# EAGLE design ece411-t03-voice-recognizer (EAGLE 9.2.1)
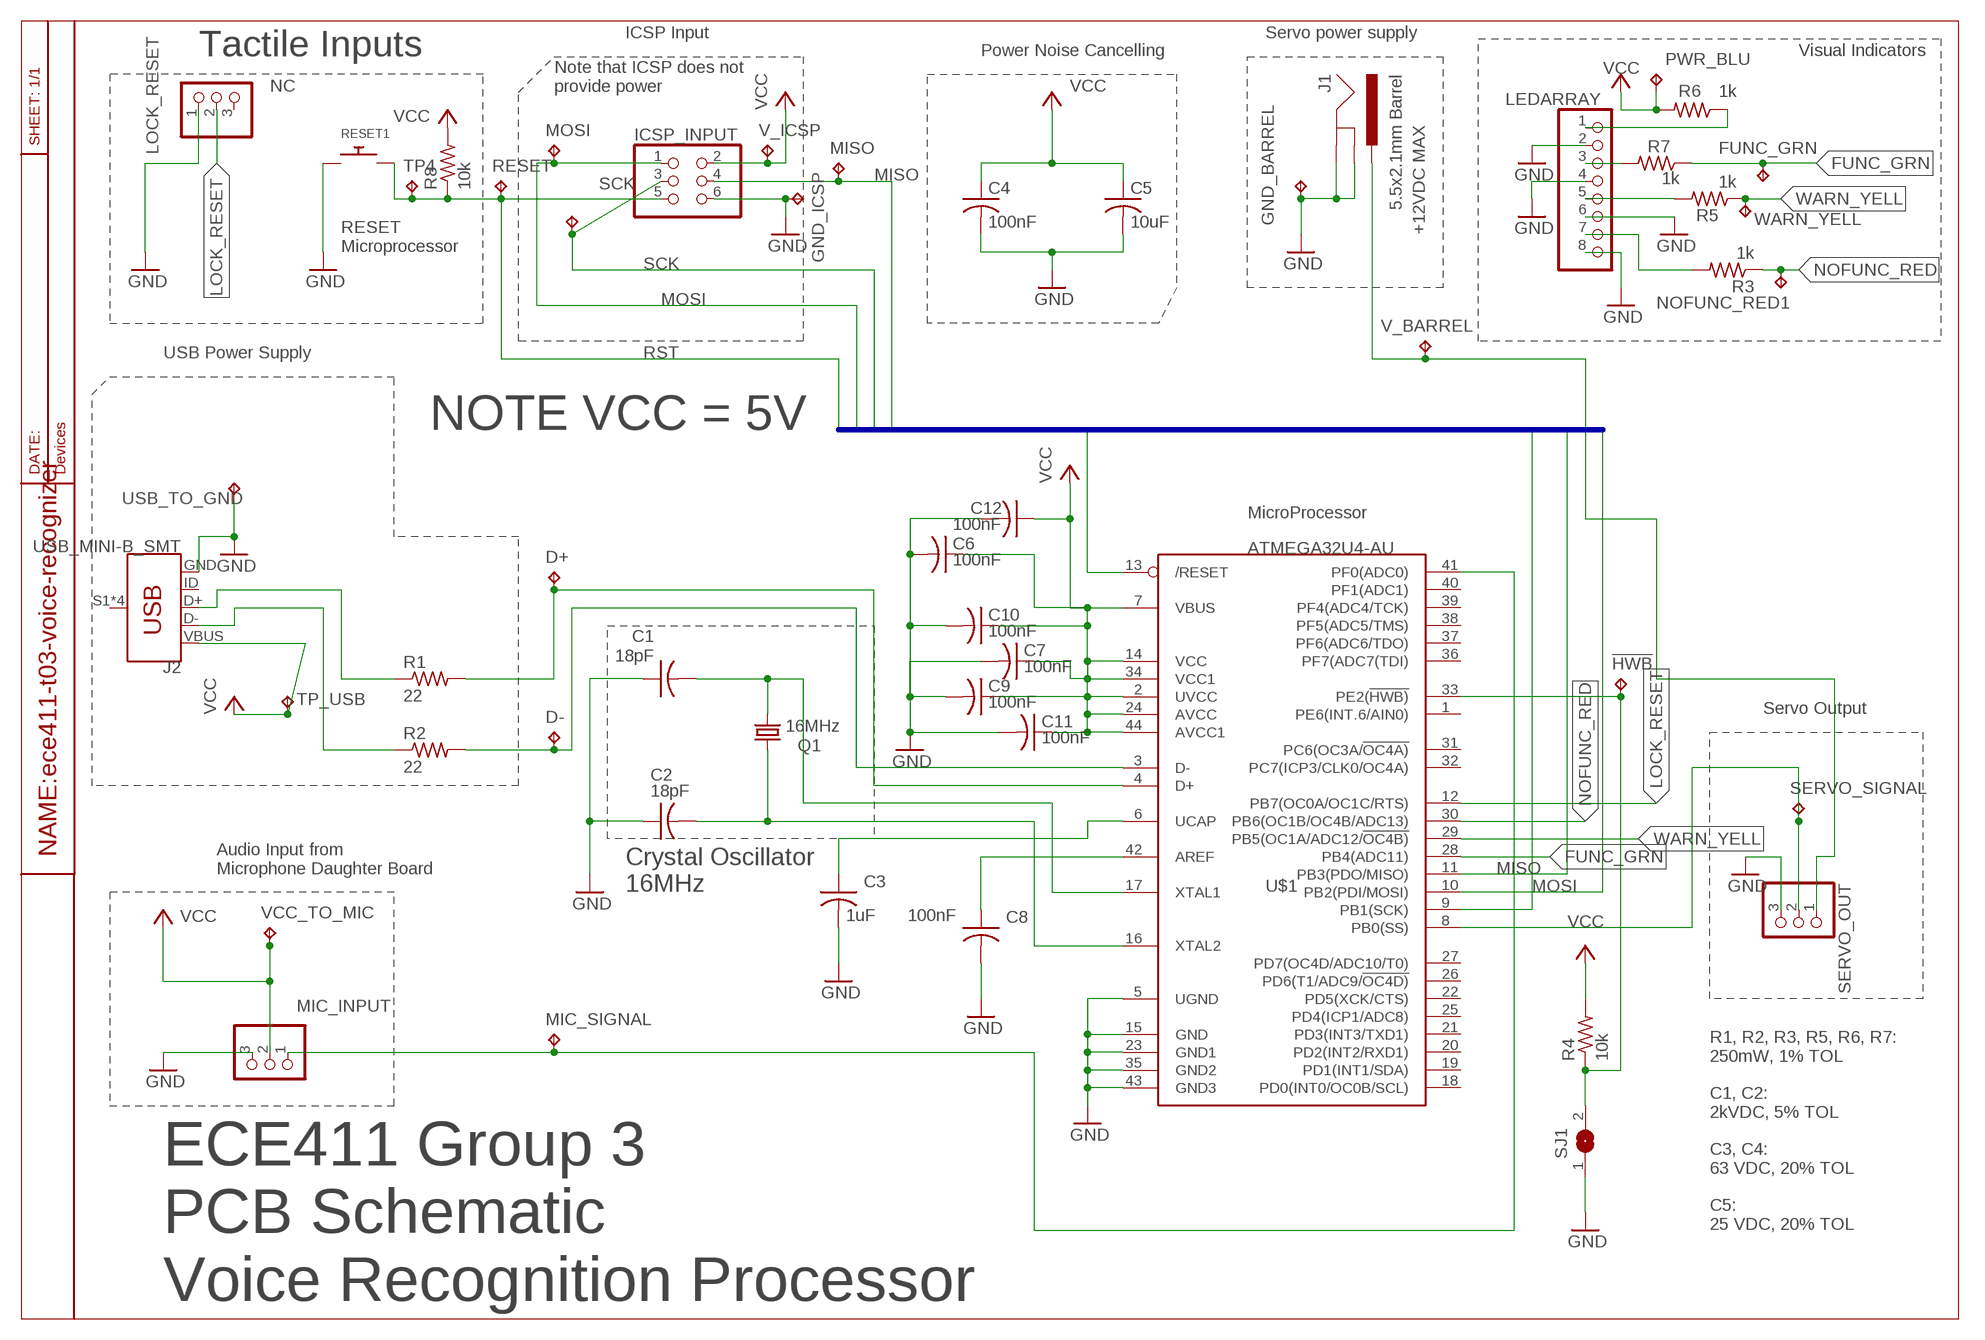
[diagram p0: schematic, sheet 1]

## Parts
!HWB  TPTP15SQ  [TP15SQ]
C1  18pF  C-USC1206  [C1206]
C2  18pF  C-USC1206  [C1206]
C3  1uF  C-USC1206  [C1206]
C4  100nF  C-USC1206  [C1206]
C5  10uF  C-USC1206  [C1206]
C6  100nF  C-USC1206  [C1206]
C7  100nF  C-USC1206  [C1206]
C8  100nF  C-USC1206  [C1206]
C9  100nF  C-USC1206  [C1206]
C10  100nF  C-USC1206  [C1206]
C11  100nF  C-USC1206  [C1206]
C12  100nF  C-USC1206  [C1206]
D+  TPTP15SQ  [TP15SQ]
D-  TPTP15SQ  [TP15SQ]
FUNC_GRN  TPTP15SQ  [TP15SQ]
GND_BARREL  TPTP15SQ  [TP15SQ]
GND_ICSP  TPTP15SQ  [TP15SQ]
ICSP_INPUT  PINHD-2X3  [2X03]
J1  5.5x2.1mm Barrel  POWER_JACKSMD  [POWER_JACK_SMD]
J2  USB_MINI-B_SMT  [USB-MINIB]
LEDARRAY  PINHD-1X8BIG  [1X08-BIG]
LOCK_RESET  PINHD-1X3  [1X03]
MIC_INPUT  PINHD-1X3  [1X03]
MIC_SIGNAL  TPTP15SQ  [TP15SQ]
MISO  TPTP15SQ  [TP15SQ]
MOSI  TPTP15SQ  [TP15SQ]
NOFUNC_RED1  TPTP15SQ  [TP15SQ]
PWR_BLU  TPTP15SQ  [TP15SQ]
Q1  16MHz  CRYSTALCTS406  [CTS406]
R1  22  R-US_M1206  [M1206]
R2  22  R-US_M1206  [M1206]
R3  1k  R-US_M1206  [M1206]
R4  10k  R-US_M1206  [M1206]
R5  1k  R-US_M1206  [M1206]
R6  1k  R-US_M1206  [M1206]
R7  1k  R-US_M1206  [M1206]
R8  10k  R-US_M1206  [M1206]
RESET  TPTP15SQ  [TP15SQ]
RESET1  SWITCH_PUSHBUTTONC&K_KSS  [BTN_CK_KSS]
SCK  TPTP15SQ  [TP15SQ]
SERVO_OUT  PINHD-1X3  [1X03]
SERVO_SIGNAL  TPTP15SQ  [TP15SQ]
SJ1  SJW  [SJW]
TP4  TPTP15SQ  [TP15SQ]
TP_USB  TPTP15SQ  [TP15SQ]
U$1  ATMEGA32U4-AU  [TQFP44]
USB_TO_GND  TPTP15SQ  [TP15SQ]
V_BARREL  TPTP15SQ  [TP15SQ]
V_ICSP  TPTP15SQ  [TP15SQ]
VCC_TO_MIC  TPTP15SQ  [TP15SQ]
WARN_YELL  TPTP15SQ  [TP15SQ]

## Nets
FUNC_GRN: FUNC_GRN.TP R7.1 U$1.28(PB4(ADC11))
GND: C1.1 C2.1 C3.2 C4.2 C5.2 C6.2 C7.2 C8.2 C9.2 C10.2 C11.2 C12.2 GND_BARREL.TP GND_ICSP.TP ICSP_INPUT.6 J1.GND(GNDBREAK) J1.P$4(GND) J2.GND LEDARRAY.2 LEDARRAY.4 LEDARRAY.6 LEDARRAY.8 LOCK_RESET.1 MIC_INPUT.3 RESET1.P$1 SERVO_OUT.3 SJ1.1 U$1.5(UGND) U$1.15(GND) U$1.23(GND1) U$1.35(GND2) U$1.43(GND3) USB_TO_GND.TP
HWB: !HWB.TP R4.1 SJ1.2 U$1.33(PE2(!HWB))
LOCK_RESET: LOCK_RESET.2 U$1.12(PB7(OC0A/OC1C/RTS))
MIC_SIGNAL: MIC_INPUT.1 MIC_SIGNAL.TP U$1.41(PF0(ADC0))
MISO: ICSP_INPUT.4 MISO.TP U$1.11(PB3(PDO/MISO))
MOSI: ICSP_INPUT.1 MOSI.TP U$1.10(PB2(PDI/MOSI))
N$1: C3.1 U$1.6(UCAP)
N$2: C1.2 Q1.3 U$1.17(XTAL1)
N$3: J2.D+ R1.1
N$4: LEDARRAY.1 R6.1
N$5: LEDARRAY.5 R5.2
N$6: LEDARRAY.7 R3.2
N$7: J1.VIN0(PWR) SERVO_OUT.1 V_BARREL.TP
N$8: LEDARRAY.3 R7.2
N$9: J2.D- R2.1
N$12: D+.TP R1.2 U$1.4(D+)
N$14: C8.1 U$1.42(AREF)
N$20: D-.TP R2.2 U$1.3(D-)
N$22: C2.2 Q1.1 U$1.16(XTAL2)
NOFUNC_RED: NOFUNC_RED1.TP R3.1 U$1.30(PB6(OC1B/OC4B/ADC13))
RST: ICSP_INPUT.5 R8.1 RESET1.P$2 RESET.TP TP4.TP U$1.13(/RESET)
SCK: ICSP_INPUT.3 SCK.TP U$1.9(PB1(SCK))
SIGNAL: SERVO_OUT.2 SERVO_SIGNAL.TP U$1.8(PB0(SS))
VCC: C4.1 C5.1 C6.1 C7.1 C9.1 C10.1 C11.1 C12.1 ICSP_INPUT.2 J2.VBUS MIC_INPUT.2 PWR_BLU.TP R4.2 R6.2 R8.2 TP_USB.TP U$1.2(UVCC) U$1.7(VBUS) U$1.14(VCC) U$1.24(AVCC) U$1.34(VCC1) U$1.44(AVCC1) V_ICSP.TP VCC_TO_MIC.TP
WARN_YELL: R5.1 U$1.29(PB5(OC1A/ADC12/!OC4B)) WARN_YELL.TP
Unconnected: J2.ID J2.S1(SHIELD) J2.S2(SHIELD) J2.S3(SHIELD) J2.S4(SHIELD) LOCK_RESET.3 U$1.1(PE6(INT.6/AIN0)) U$1.18(PD0(INT0/OC0B/SCL)) U$1.19(PD1(INT1/SDA)) U$1.20(PD2(INT2/RXD1)) U$1.21(PD3(INT3/TXD1)) U$1.22(PD5(XCK/CTS)) U$1.25(PD4(ICP1/ADC8)) U$1.26(PD6(T1/ADC9/!OC4D)) U$1.27(PD7(OC4D/ADC10/T0)) U$1.31(PC6(OC3A/!OC4A)) U$1.32(PC7(ICP3/CLK0/OC4A)) U$1.36(PF7(ADC7(TDI)) U$1.37(PF6(ADC6/TDO)) U$1.38(PF5(ADC5/TMS)) U$1.39(PF4(ADC4/TCK)) U$1.40(PF1(ADC1))

## Buses
MISO,MOSI,RST,SCK

## Notes on the sheet
- ICSP Input | Servo power supply
- Tactile Inputs | Power Noise Cancelling | Visual Indicators
- NC
- Note that ICSP does not
  provide power
- +12VDC MAX
- RESET 
  Microprocessor
- USB Power Supply
- NOTE VCC = 5V
- MicroProcessor
- Servo Output
- Audio Input from 
  Microphone Daughter Board
- Crystal Oscillator
  16MHz
- R1, R2, R3, R5, R6, R7:
  250mW, 1% TOL
  
  C1, C2:
  2kVDC, 5% TOL
  
  C3, C4:
  63 VDC, 20% TOL
  
  C5:
  25 VDC, 20% TOL
- ECE411 Group 3
  PCB Schematic
  Voice Recognition Processor

## Library data of the parts
!HWB D+ D- FUNC_GRN GND_BARREL GND_ICSP MIC_SIGNAL MISO MOSI NOFUNC_RED1 PWR_BLU RESET SCK SERVO_SIGNAL TP4 TP_USB USB_TO_GND V_BARREL V_ICSP VCC_TO_MIC WARN_YELL = testpad:TP: Test pad
C1-C12 = rcl:C-US: CAPACITOR, American symbol; SPICEPREFIX: C
ICSP_INPUT = pinhead:PINHD-2X3: PIN HEADER
J1 = SparkFun-Connectors:POWER_JACK: Power Jack Connector This is the standard 5.5mm barrel jack for power. The PTH is the most common, proven, reliable, footprint. The Slot footprint only works if the mill layer is transmitted to the PCB fab house so be warned. Here are the connectors we sell at SparkFun: DC Barrel Power Jack/Connector <https://www.sparkfun.com/products/119> (PRT-00119) DC Barrel Power Jack/Connector (SMD) <https://www.sparkfun.com/products/12748> (PRT-12748) DC Barrel Jack Adapter - Breadboard Compatible <https://www.sparkfun.com/products/10811> (PRT-10811) It is used on this SparkFun product (and many, many others): SparkFun RedBoard - Programmed with Arduino <https://www.sparkfun.com/products/12757> (DEV-12757) Also, if you need a mating power supply or connector, please check these out: Wall Adapter Power Supply - 9VDC 650mA <https://www.sparkfun.com/products/298> (TOL-00298) DC Barrel Jack Adapter - Male <https://www.sparkfun.com/products/10287> (PRT-10287); PROD_ID: CONN-08106; SF_ID: PRT-12748
J2 = SparkFun-Connectors:USB_MINI-B: USB type Mini-B Connector Breaks out 5th pin, and includes shield pins if needed. SparkFun Products: SparkFun FTDI Basic Breakout <https://www.sparkfun.com/products/9716> SparkFun XBee Explorer USB <https://www.sparkfun.com/products/11812> SparkFun Redboard <https://www.sparkfun.com/products/12757>; PROD_ID: CONN-08193; SF_ID: PRT-00587
LEDARRAY = adafruit:PINHD-1X8: PIN HEADER
LOCK_RESET = adafruit:PINHD-1X3: PIN HEADER
MIC_INPUT SERVO_OUT = pinhead:PINHD-1X3: PIN HEADER
Q1 = adafruit:CRYSTAL: CRYSTAL; OC_FARNELL: unknown; OC_NEWARK: unknown
R1-R8 = rcl:R-US_: RESISTOR, American symbol; SPICEPREFIX: R
RESET1 = adafruit:SWITCH_PUSHBUTTON: Buttons SOFTTOUCHSMD_SJ - Soft touch temporary push button (Super Junk Akihabara) Compatible with SKPMANE010 [Mouser: 688-SKPMAN] C&K_KSS = Digikey: KSS221GLFS
SJ1 = jumper:SJ: SMD solder JUMPER
U$1 = adafruit:ATMEGA32U4: http://www.ladyada.net/library/eagle

## Net classes
0 VCC: width 0.05 mm
1 GND: width 0.001 mm

## Board
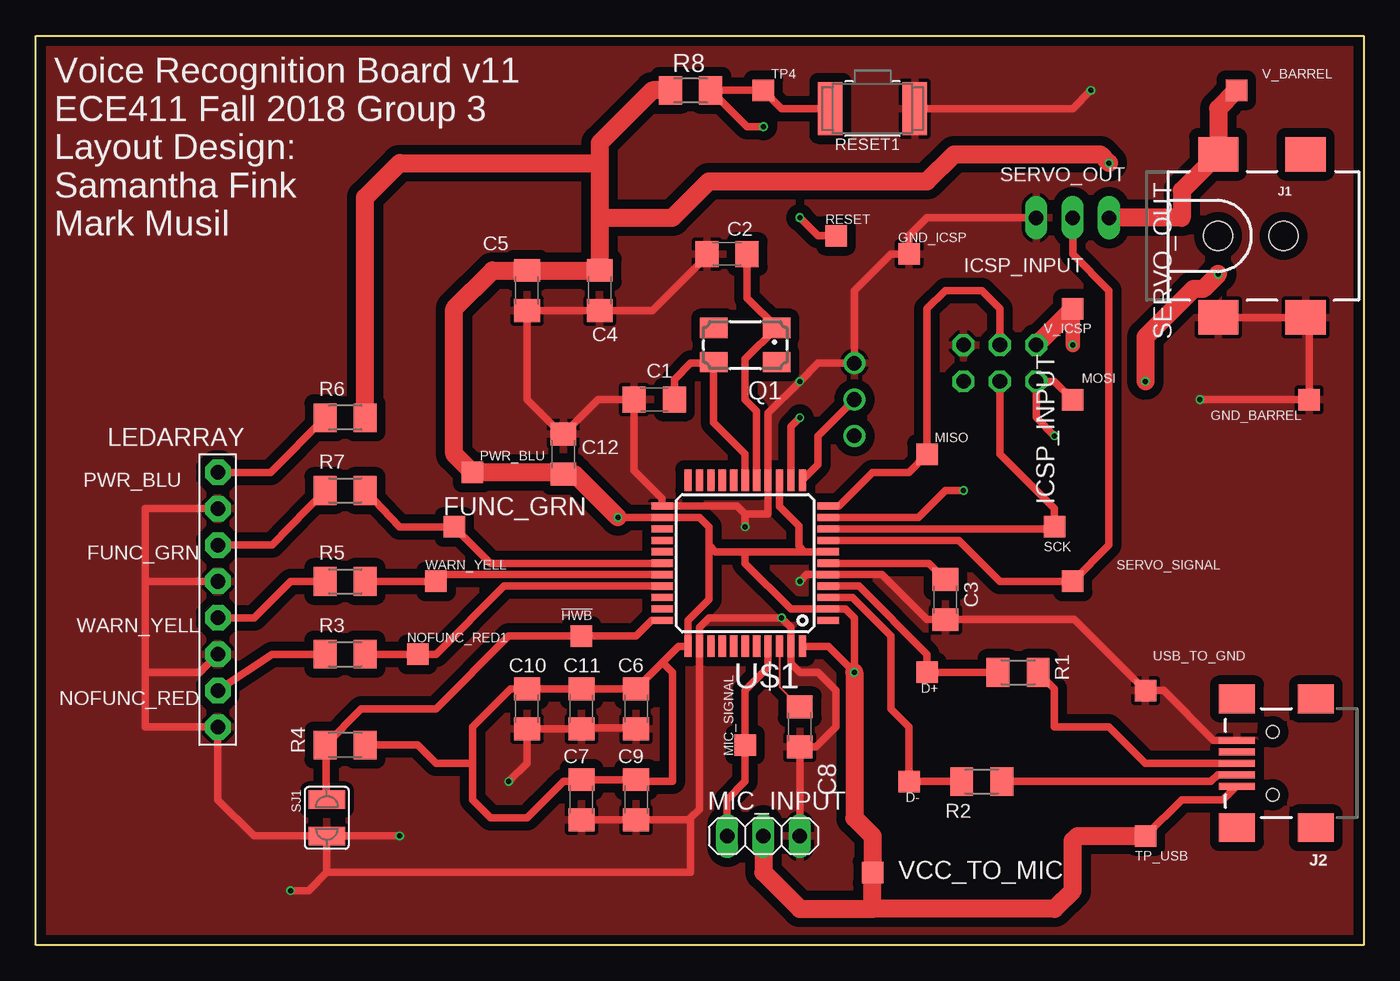
[diagram p1: board, top side]
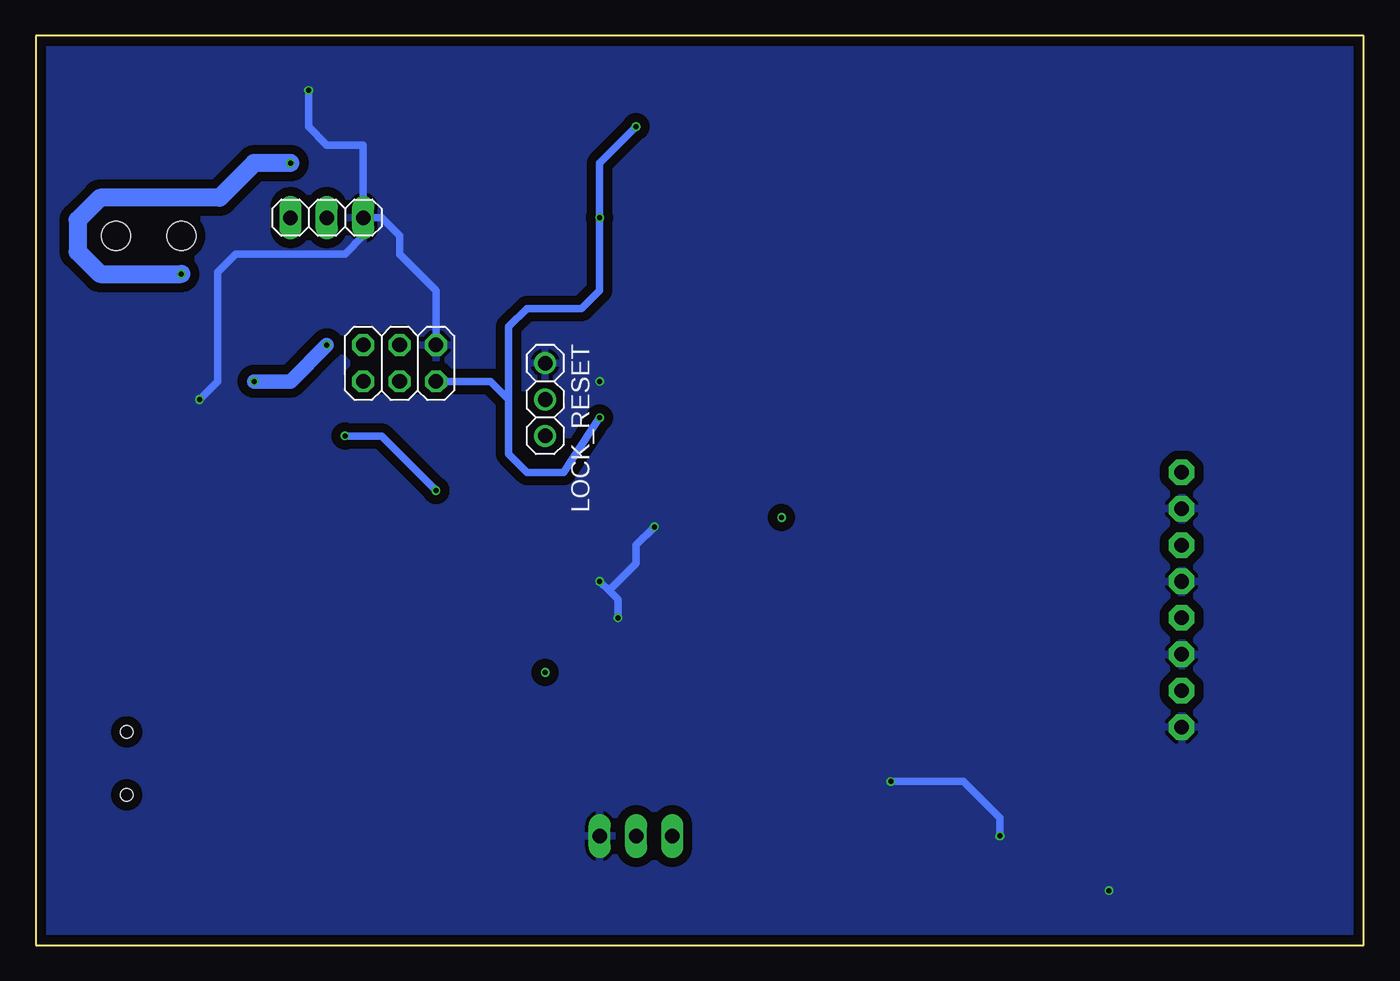
[diagram p2: board, bottom side, seen from below]

Size 92.71 x 63.5 mm. Coordinates in mm from the lower left corner, seen from the top.
Outline: 0,0 0,63.5 92.71,63.5 92.71,0 0,0
Copper layers (1*16): Top 0.035559375mm / dielectric 1.6mm / Bottom 0.035559375mm
Design rules "oshpark-2layer": minimum track width 6mil, minimum drill 10mil, track to track 6mil, track to pad 6mil, pad to pad 6mil, via to via 6mil, smd to smd 6mil, copper to edge 15mil, drill to drill 6mil, minimum pad ring 5mil, minimum via ring 5mil, stop-mask expansion 2.5mil, vias tented up to drill 0mil, thermal gap 10mil

### Footprints (pad centres in the part's own frame; a part is rotated, then mirrored left to right if it is on the bottom)
TP15SQ = smd 1.5 x 1.5: TP 0,0
C1206 = smd 1.6 x 1.8: 1 -1.4,0; 2 1.4,0
2X03 = drill 1.016 octagon: 1 -2.54,-1.27; 2 -2.54,1.27; 3 0,-1.27; 4 0,1.27; 5 2.54,-1.27; 6 2.54,1.27
POWER_JACK_SMD = smd 2.8 x 2.4: GND 0,-5.7; P$4 6.1,-5.7; VIN0 0,5.7; VIN1 6.1,5.7 | hole 2.032: 0,0; 4.572,0
USB-MINIB = smd 2.5 x 0.5: D+ 2.5,0; D- 2.5,0.8; GND 2.5,-1.6; ID 2.5,-0.8; VBUS 2.5,1.6 | smd 2.5 x 2: S1 -3,4.5; S2 2.5,4.5; S3 -3,-4.5; S4 2.5,-4.5 | hole 0.9: 0,2.2; 0,-2.2
1X08-BIG = drill 1.016 pad 1.778 octagon: 1 -8.89,0; 2 -6.35,0; 3 -3.81,0; 4 -1.27,0; 5 1.27,0; 6 3.81,0; 7 6.35,0; 8 8.89,0
1X03 = drill 1.016: 1 -2.54,0; 2 0,0; 3 2.54,0
1X03' = drill 1.016 long: 1 -2.54,0; 2 0,0; 3 2.54,0
CTS406 = smd 1.9 x 1.4: 1 -2.2,-1.2; 2 2.2,-1.2; 3 2.2,1.2; 4 -2.2,1.2
M1206 = smd 1.6 x 2: 1 -1.4,0; 2 1.4,0
BTN_CK_KSS = smd 1.7 x 3.7: P$1 -2.95,0; P$2 2.95,0
SJW = smd 1.27 x 2.54: 1 -1.27,0; 2 1.27,0
TQFP44 = smd 1.5 x 0.5: 1 -5.8,4; 2 -5.8,3.2; 3 -5.8,2.4; 4 -5.8,1.6; 5 -5.8,0.8; 6 -5.8,0; 7 -5.8,-0.8; 8 -5.8,-1.6; 9 -5.8,-2.4; 10 -5.8,-3.2; 11 -5.8,-4; 23 5.8,-4; 24 5.8,-3.2; 25 5.8,-2.4; 26 5.8,-1.6; 27 5.8,-0.8; 28 5.8,0; 29 5.8,0.8; 30 5.8,1.6; 31 5.8,2.4; 32 5.8,3.2; 33 5.8,4 | smd 0.5 x 1.5: 12 -4,-5.8; 13 -3.2,-5.8; 14 -2.4,-5.8; 15 -1.6,-5.8; 16 -0.8,-5.8; 17 0,-5.8; 18 0.8,-5.8; 19 1.6,-5.8; 20 2.4,-5.8; 21 3.2,-5.8; 22 4,-5.8; 34 4,5.8; 35 3.2,5.8; 36 2.4,5.8; 37 1.6,5.8; 38 0.8,5.8; 39 0,5.8; 40 -0.8,5.8; 41 -1.6,5.8; 42 -2.4,5.8; 43 -3.2,5.8; 44 -4,5.8

### Placement (x,y rotation side)
!HWB  38.1,21.59 0 top
C1  43.18,38.1 0 top
C2  48.26,48.26 0 top
C3  63.5,24.13 270 top
C4  39.37,45.72 270 top
C5  34.29,45.72 270 top
C6  41.91,16.51 270 top
C7  38.1,10.16 270 top
C8  53.34,15.24 270 top
C9  41.91,10.16 270 top
C10  34.29,16.51 270 top
C11  38.1,16.51 270 top
C12  36.83,34.29 90 top
D+  62.23,19.05 0 top
D-  60.96,11.43 0 top
FUNC_GRN  29.21,29.21 0 top
GND_BARREL  88.9,38.1 180 top
GND_ICSP  60.96,48.26 0 top
ICSP_INPUT  67.31,40.64 0 bottom
J1  82.55,49.53 0 top
J2  86.36,12.7 180 top
LEDARRAY  12.7,24.13 270 top
LOCK_RESET  57.15,38.1 270 bottom
MIC_INPUT  [1X03']  50.8,7.62 0 top
MIC_SIGNAL  49.53,13.97 0 top
MISO  62.23,34.29 0 top
MOSI  72.39,38.1 0 top
NOFUNC_RED1  26.67,20.32 0 top
PWR_BLU  30.48,33.02 180 top
Q1  49.53,41.91 180 top
R1  68.58,19.05 180 top
R2  66.04,11.43 180 top
R3  21.59,20.32 180 top
R4  21.59,13.97 0 top
R5  21.59,25.4 180 top
R6  21.59,36.83 0 top
R7  21.59,31.75 180 top
R8  45.72,59.69 180 top
RESET  55.88,49.53 0 top
RESET1  58.42,58.42 180 top
SCK  71.12,29.21 0 top
SERVO_OUT  [1X03']  72.39,50.8 0 bottom
SERVO_SIGNAL  72.39,25.4 0 top
SJ1  20.32,8.89 90 top
TP4  50.8,59.69 270 top
TP_USB  77.47,7.62 0 top
U$1  49.53,26.67 180 top
USB_TO_GND  77.47,17.78 0 top
V_BARREL  83.82,59.69 0 top
V_ICSP  72.39,44.45 0 top
VCC_TO_MIC  58.42,5.08 0 top
WARN_YELL  27.94,25.4 0 top

### Tracks (layer width: path | path; a pad name or v marks a point on that pad's centre or on a via)
FUNC_GRN
  Top 0.508: U$1.28 31.75,26.67 FUNC_GRN.TP 25.4,29.21 R7.1
GND  (via drill 0.35)
  Top 0.152: 55.88,25.87 U$1.5
  Top 0.508: LEDARRAY.6 11.43,19.05 7.62,19.05 | 7.62,19.05 7.62,15.24 LEDARRAY.8 12.7,10.16 15.24,7.62 SJ1.1 | LEDARRAY.4 7.62,25.4 | 7.62,25.4 7.62,19.05 | 7.62,25.4 7.62,30.48 LEDARRAY.2 | v53.34,25.4 53.81,25.87 U$1.5 | 55.88,25.87 59.09,25.87 62.23,22.73 C3.2 72.52,22.73 USB_TO_GND.TP 78.74,17.78 82.22,14.3 J2.GND | C6.2 41.97,15.18 38.17,15.18 C11.2 C10.2 34.29,12.7 v33.02,11.43 | 20.32,5.08 45.72,5.08 45.72,8.89 | 45.72,8.89 45.59,8.76 C9.2 C7.2 | C2.1 46.86,48.13 43.05,44.32 C4.2 C5.2 34.29,38.1 36.7,35.69 C12.2 39.24,38.1 C1.1 41.78,33.15 43.73,31.2 U$1.23 48.95,30.67 49.53,30.09 | 45.72,8.89 46.33,9.5 U$1.35 46.33,22.2 46.99,22.86 v52.07,22.86 52.73,22.2 U$1.43 52.73,19.66 53.34,19.05 54.61,19.05 55.88,17.78 55.88,15.24 54.48,13.84 C8.2 MIC_INPUT.3 | v25.4,7.62 SJ1.1 | SJ1.1 20.32,5.08 | v17.78,3.81 19.05,3.81 20.32,5.08 | J1.GND J1.P$4 88.9,43.58 GND_BARREL.TP v81.28,38.1 | v73.66,59.69 72.39,58.42 RESET1.P$1 | SERVO_OUT.3 62.23,50.8 60.96,49.53 GND_ICSP.TP 59.69,48.26 57.15,45.72 LOCK_RESET.1 54.61,40.64 v53.34,39.37 51.13,37.16 U$1.15 51.13,30.09 49.53,30.09 | v49.53,29.21 49.53,30.09
  Bottom 0.508: v52.07,22.86 52.07,24.13 52.7,24.77 | 52.7,24.77 v53.34,25.4 | ICSP_INPUT.6 64.77,45.72 67.31,48.26 67.31,49.53 68.58,50.8 SERVO_OUT.3 | v25.4,7.62 25.4,8.89 27.94,11.43 v33.02,11.43 | SERVO_OUT.3 69.85,49.53 71.12,48.26 78.74,48.26 80.01,46.99 80.01,39.37 v81.28,38.1 | SERVO_OUT.3 69.85,55.88 72.39,55.88 73.66,57.15 v73.66,59.69 | 52.7,24.77 50.8,26.67 50.8,27.94 v49.53,29.21
  pour Top (isolate 0.635): 0,63.5 0,0 92.71,0 92.71,63.5
  pour Bottom (isolate 0.635): 0,63.5 0,0 92.71,0 92.71,63.5
HWB
  Top 0.508: U$1.33 42.99,22.67 41.91,21.59 !HWB.TP 33.02,21.59 27.94,16.51 22.73,16.51 20.25,14.04 | 20.25,14.04 R4.1 | SJ1.2 20.25,10.22 20.25,14.04
LOCK_RESET
  Top 0.508: U$1.12 54.61,33.55 54.61,35.56 LOCK_RESET.2
MIC_SIGNAL
  Top 0.508: U$1.41 51.13,19.38 49.53,17.78 MIC_SIGNAL.TP 49.53,11.43 48.26,10.16 MIC_INPUT.1
MISO
  Top 0.508: ICSP_INPUT.4 67.31,44.45 66.04,45.72 63.5,45.72 62.23,44.45 MISO.TP 60.96,33.02 58.42,33.02 56.07,30.67 U$1.11
MOSI  (via drill 0.35)
  Top 0.508: MOSI.TP 71.12,39.37 ICSP_INPUT.1 69.85,36.83 v71.12,35.56 | U$1.10 61.62,29.87 63.5,31.75 v64.77,31.75
  Bottom 0.508: v64.77,31.75 68.58,35.56 v71.12,35.56
N$1
  Top 0.508: C3.1 62.36,26.67 U$1.6
N$2
  Top 0.152: 47.33,40.64 Q1.3 | 49.53,33.02 U$1.17
  Top 0.508: C1.2 44.58,39.5 45.72,40.64 47.33,40.64 | Q1.3 47.33,36.49 49.53,34.29 49.53,33.02
N$3
  Top 0.508: J2.D+ 77.47,12.7 74.93,15.24 71.12,15.24 71.12,17.91 R1.1
N$4
  Top 0.508: R6.1 16.38,33.02 LEDARRAY.1
N$5
  Top 0.508: R5.2 17.78,25.4 15.24,22.86 LEDARRAY.5
N$6
  Top 0.508: R3.2 16.51,20.32 LEDARRAY.7
N$7
  Top 1.27: V_BARREL.TP 82.55,58.42 J1.VIN0 80.01,52.69 80.01,50.8 SERVO_OUT.1
N$8
  Top 0.508: R7.2 16.51,27.94 LEDARRAY.3
N$9
  Top 0.508: R2.1 74.93,11.43 82.04,11.43 82.51,11.9 J2.D-
N$12
  Top 0.508: R1.2 D+.TP 62.23,20.32 57.48,25.07 U$1.4
N$14
  Top 0.152: U$1.42 51.93,18.05 C8.1
N$20
  Top 0.508: U$1.3 57.01,24.27 59.69,21.59 59.69,16.51 60.96,15.24 D-.TP R2.2
N$22
  Top 0.508: C2.2 49.66,45.18 Q1.1 49.53,40.91 49.53,38.1 50.33,37.3 U$1.16
NOFUNC_RED
  Top 0.508: U$1.30 32.69,25.07 27.94,20.32 NOFUNC_RED1.TP R3.1
RST  (via drill 0.35)
  Top 0.508: RESET1.P$2 52.07,58.42 TP4.TP R8.1 49.66,57.15 v50.8,57.15 | RESET.TP 54.61,49.53 v53.34,50.8 | v53.34,36.83 52.73,36.22 U$1.13
  Bottom 0.508: 59.69,38.1 59.69,43.18 58.42,44.45 54.61,44.45 53.34,45.72 v53.34,50.8 53.34,54.61 v50.8,57.15 | 59.69,38.1 60.96,39.37 ICSP_INPUT.5 | 59.69,38.1 59.69,34.29 58.42,33.02 55.88,33.02 v53.34,36.83
SCK
  Top 0.508: ICSP_INPUT.3 67.31,34.29 71.12,30.48 SCK.TP 70.98,29.07 U$1.9
SIGNAL
  Top 0.508: U$1.8 64.44,28.27 67.31,25.4 SERVO_SIGNAL.TP 74.93,27.94 74.93,45.72 72.39,48.26 SERVO_OUT.2
VCC  (via drill 0.35)
  Top 0.152: 55.88,23.47 U$1.2
  Top 0.508: v40.64,29.87 U$1.24 46.33,29.87 46.99,29.21 46.99,27.94 | U$1.2 52.73,23.47 49.53,26.67 49.53,27.47 | 55.88,23.47 56.54,23.47 57.15,22.86 v57.15,19.05 55.33,20.87 U$1.44 | 55.88,23.47 | 43.75,19.75 44.87,20.87 U$1.34 45.53,22.67 46.99,24.13 46.99,27.94 | 43.75,19.75 C6.1 C11.1 C10.1 33.15,17.91 30.48,15.24 30.48,12.7 | U$1.7 53.67,27.47 | 53.67,27.47 53.27,27.87 53.27,29.28 51.93,30.62 U$1.14 | 43.75,19.75 44.45,19.05 44.45,11.43 42.04,11.43 C9.1 C7.1 37.97,11.43 36.83,11.43 34.29,8.89 31.75,8.89 30.48,10.16 30.48,12.7 | R4.2 26.67,13.97 27.94,12.7 30.48,12.7 | 46.99,27.94 47.46,27.47 49.53,27.47 | 49.53,27.47 53.67,27.47 | J2.VBUS 83.82,11.1 82.88,10.16 80.01,10.16 TP_USB.TP
  Top 1.016: V_ICSP.TP v72.39,41.91
  Top 1.27: R8.2 43.05,59.69 39.37,56.01 39.37,54.61 | 39.37,54.61 39.37,50.8 | V_ICSP.TP ICSP_INPUT.2 | v40.64,29.87 37.62,32.89 C12.1 36.83,33.02 PWR_BLU.TP 29.21,34.29 29.21,44.45 31.88,47.12 C5.1 C4.1 39.37,50.8 | 58.42,2.54 VCC_TO_MIC.TP 58.42,7.62 57.15,8.89 v57.15,19.05 | 39.37,50.8 44.45,50.8 46.99,53.34 62.23,53.34 64.12,55.23 74.31,55.23 v74.93,54.61 | 39.37,54.61 25.4,54.61 22.99,52.2 R6.2 | v82.55,46.86 81.5,45.82 80.82,45.82 77.47,42.46 v77.47,39.37 | 58.42,2.54 71.12,2.54 72.39,3.81 72.39,7.29 72.72,7.62 TP_USB.TP | MIC_INPUT.2 50.8,5.08 53.34,2.54 58.42,2.54
  Bottom 1.016: v72.39,41.91 74.93,39.37 v77.47,39.37
  Bottom 1.27: v74.93,54.61 77.47,54.61 79.88,52.2 88.23,52.2 89.79,50.63 89.79,48.42 88.23,46.86 v82.55,46.86
WARN_YELL
  Top 0.508: U$1.29 28.41,25.87 WARN_YELL.TP R5.1

### Text on the board
tPlace: SERVO_OUT | Voice Recognition Board v11 / ECE411 Fall 2018 Group 3 / Layout Design: / Samantha Fink / Mark Musil | ICSP_INPUT | PWR_BLU | FUNC_GRN | WARN_YELL | NOFUNC_RED